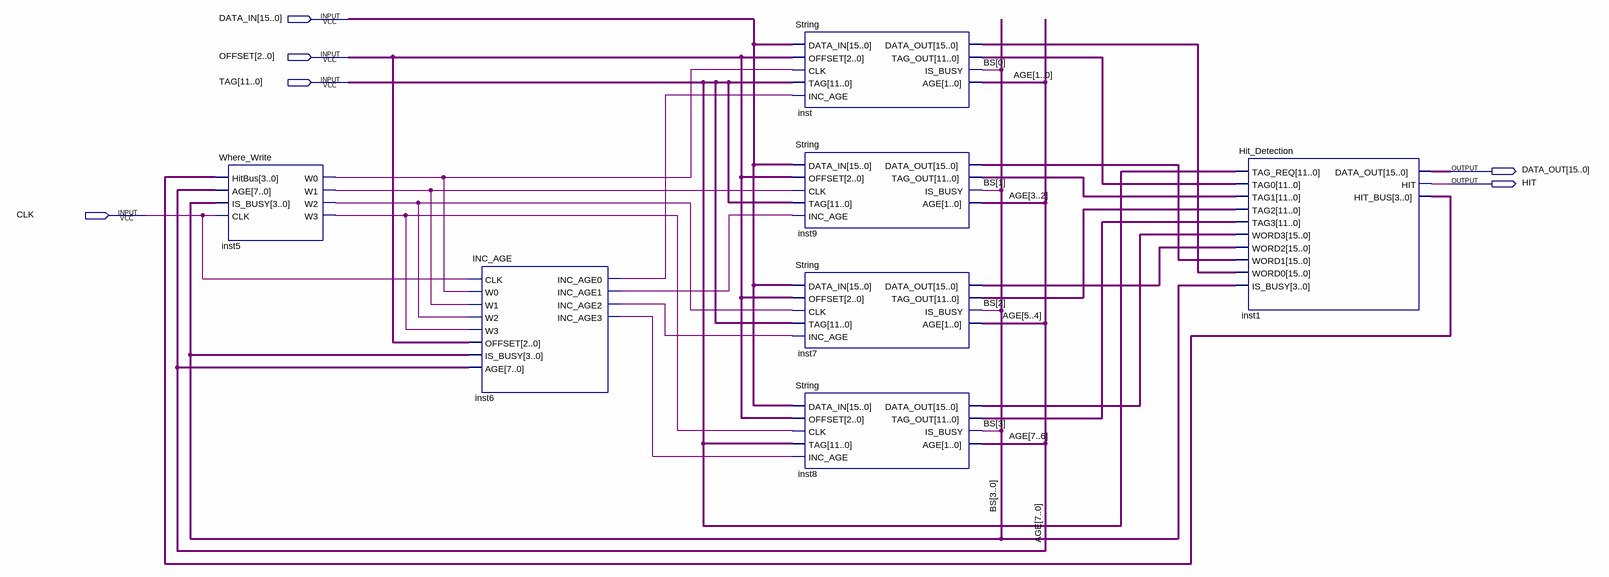
[diagram p0: schematic sheet]
// Quartus schematic Line.bdf as structural Verilog: 7 symbols, 6 pins
module Line (
  input  [15:0] DATA_IN,
  input  [2:0] OFFSET,
  input  [11:0] TAG,
  input  CLK,
  output [15:0] DATA_OUT,
  output HIT
);

  wire inst5_w0, inst5_w1, inst5_w2, inst5_w3, inst6_inc_age0, inst6_inc_age1, inst6_inc_age2, inst6_inc_age3;
  wire [3:0] BS, inst1_hit_bus;
  wire [7:0] AGE;
  wire [11:0] inst7_tag_out, inst8_tag_out, inst9_tag_out, inst_tag_out;
  wire [15:0] inst7_data_out, inst8_data_out, inst9_data_out, inst_data_out;

  Where_Write inst5 (
    .HitBus(inst1_hit_bus), .AGE(AGE), .IS_BUSY(BS), .CLK(CLK), .W0(inst5_w0), .W1(inst5_w1), .W2(inst5_w2),
    .W3(inst5_w3));
  INC_AGE inst6 (
    .CLK(CLK), .W0(inst5_w0), .W1(inst5_w1), .W2(inst5_w2), .W3(inst5_w3), .OFFSET(OFFSET), .IS_BUSY(BS),
    .AGE(AGE), .INC_AGE0(inst6_inc_age0), .INC_AGE1(inst6_inc_age1), .INC_AGE2(inst6_inc_age2),
    .INC_AGE3(inst6_inc_age3));
  String inst (
    .DATA_IN(DATA_IN), .OFFSET(OFFSET), .CLK(inst5_w0), .TAG(TAG), .INC_AGE(inst6_inc_age0),
    .DATA_OUT(inst_data_out), .TAG_OUT(inst_tag_out), .IS_BUSY(BS[0]), .AGE(AGE[1:0]));
  String inst9 (
    .DATA_IN(DATA_IN), .OFFSET(OFFSET), .CLK(inst5_w1), .TAG(TAG), .INC_AGE(inst6_inc_age1),
    .DATA_OUT(inst9_data_out), .TAG_OUT(inst9_tag_out), .IS_BUSY(BS[1]), .AGE(AGE[3:2]));
  String inst7 (
    .DATA_IN(DATA_IN), .OFFSET(OFFSET), .CLK(inst5_w2), .TAG(TAG), .INC_AGE(inst6_inc_age2),
    .DATA_OUT(inst7_data_out), .TAG_OUT(inst7_tag_out), .IS_BUSY(BS[2]), .AGE(AGE[5:4]));
  String inst8 (
    .DATA_IN(DATA_IN), .OFFSET(OFFSET), .CLK(inst5_w3), .TAG(TAG), .INC_AGE(inst6_inc_age3),
    .DATA_OUT(inst8_data_out), .TAG_OUT(inst8_tag_out), .IS_BUSY(BS[3]), .AGE(AGE[7:6]));
  Hit_Detection inst1 (
    .TAG_REQ(TAG), .TAG0(inst_tag_out), .TAG1(inst9_tag_out), .TAG2(inst7_tag_out), .TAG3(inst8_tag_out),
    .WORD3(inst8_data_out), .WORD2(inst7_data_out), .WORD1(inst9_data_out), .WORD0(inst_data_out),
    .IS_BUSY(BS), .DATA_OUT(DATA_OUT), .HIT(HIT), .HIT_BUS(inst1_hit_bus));
endmodule
